# Altium schematic sheet [2]_USB_Interface.SchDoc: USB
size A3; Author: Eladio Delgado; CompanyName: bq - Mundo Reader; Organization: bq - Mundo Reader; Revision: 0; SheetNumber: 2; SheetTotal: 5
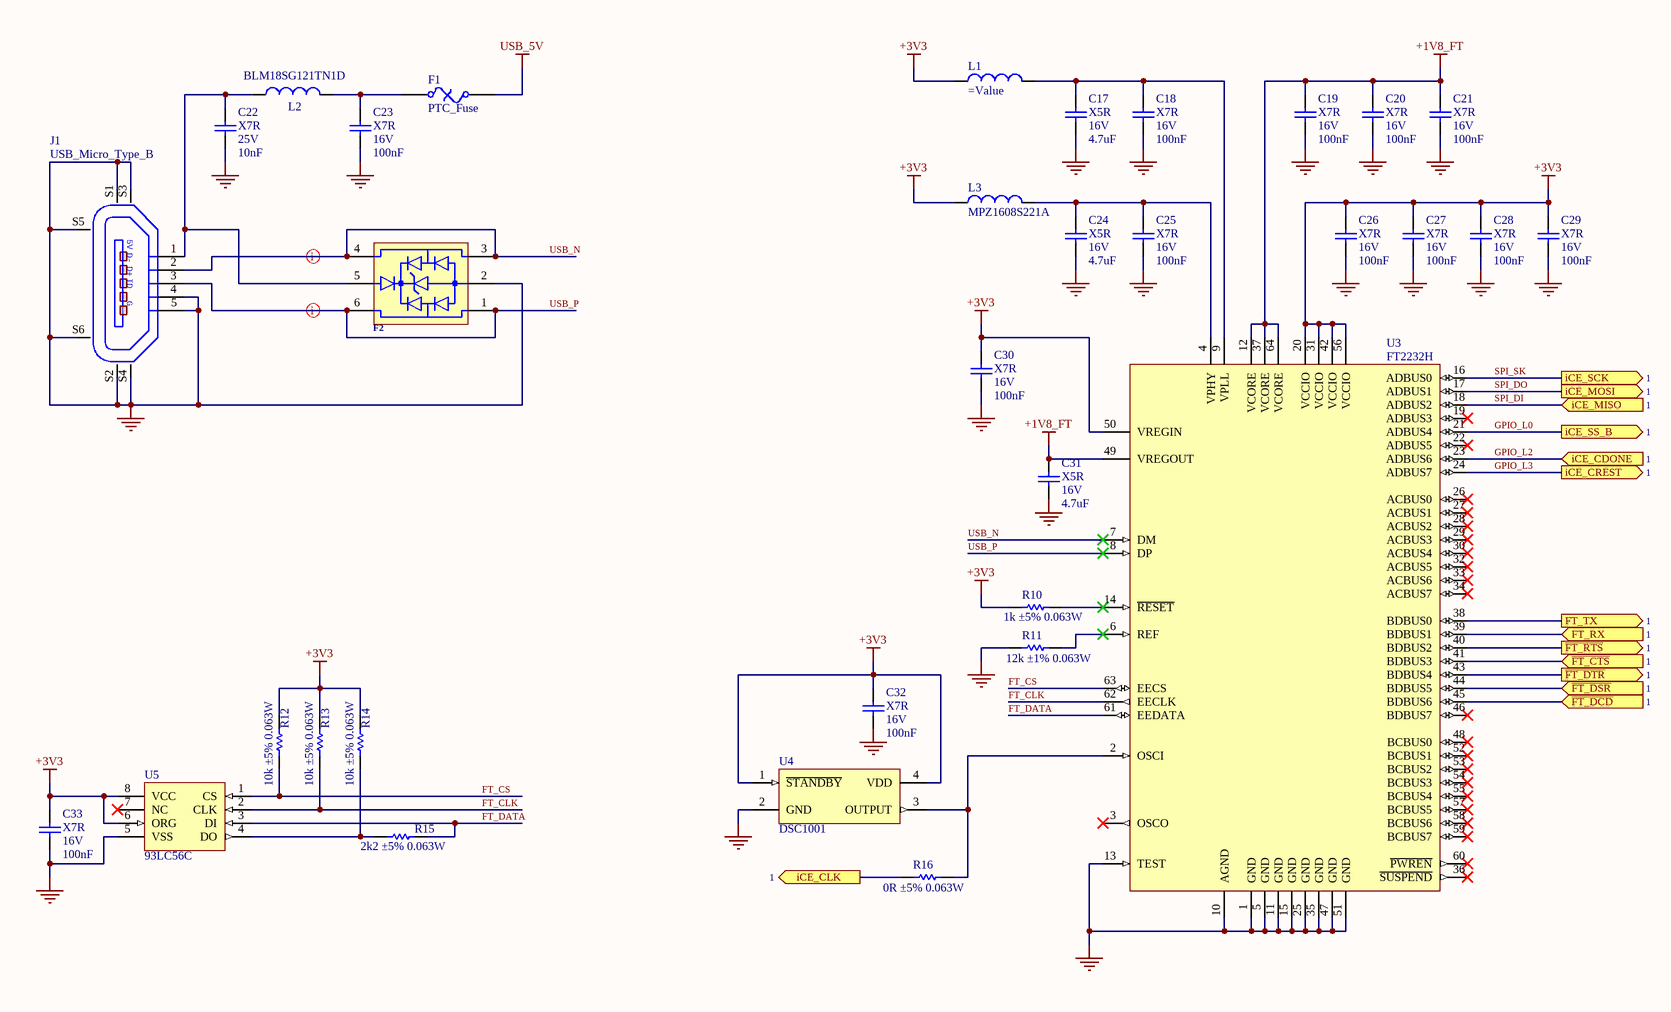
[diagram p0: [2]_USB_Interface.SchDoc]

## Parts
C17  Dielectric: X5R  Voltage: 16V  Capacitance: 4.7uF  [C0603]  (hidden comment: Capacitor)
C18  Dielectric: X7R  Voltage: 16V  Capacitance: 100nF  [C0402]  (hidden comment: Capacitor)
C19  Dielectric: X7R  Voltage: 16V  Capacitance: 100nF  [C0402]  (hidden comment: Capacitor)
C20  Dielectric: X7R  Voltage: 16V  Capacitance: 100nF  [C0402]  (hidden comment: Capacitor)
C21  Dielectric: X7R  Voltage: 16V  Capacitance: 100nF  [C0402]  (hidden comment: Capacitor)
C22  Dielectric: X7R  Voltage: 25V  Capacitance: 10nF  [C0603]  (hidden comment: Capacitor)
C23  Dielectric: X7R  Voltage: 16V  Capacitance: 100nF  [C0402]  (hidden comment: Capacitor)
C24  Dielectric: X5R  Voltage: 16V  Capacitance: 4.7uF  [C0603]  (hidden comment: Capacitor)
C25  Dielectric: X7R  Voltage: 16V  Capacitance: 100nF  [C0402]  (hidden comment: Capacitor)
C26  Dielectric: X7R  Voltage: 16V  Capacitance: 100nF  [C0402]  (hidden comment: Capacitor)
C27  Dielectric: X7R  Voltage: 16V  Capacitance: 100nF  [C0402]  (hidden comment: Capacitor)
C28  Dielectric: X7R  Voltage: 16V  Capacitance: 100nF  [C0402]  (hidden comment: Capacitor)
C29  Dielectric: X7R  Voltage: 16V  Capacitance: 100nF  [C0402]  (hidden comment: Capacitor)
C30  Dielectric: X7R  Voltage: 16V  Capacitance: 100nF  [C0402]  (hidden comment: Capacitor)
C31  Dielectric: X5R  Voltage: 16V  Capacitance: 4.7uF  [C0603]  (hidden comment: Capacitor)
C32  Dielectric: X7R  Voltage: 16V  Capacitance: 100nF  [C0402]  (hidden comment: Capacitor)
C33  Dielectric: X7R  Voltage: 16V  Capacitance: 100nF  [C0402]  (hidden comment: Capacitor)
F1  PTC_Fuse  [F1812]
F2  ESDUSB  [SOT563]  (value not drawn)
J1  USB_Micro_Type_B  [USB_Micro_B]
L1  (no value)  [L0805]
L2  BLM18SG121TN1D  [L0603]
L3  MPZ1608S221A  [L0603]
R10  value 1k ±5% 0.063W  [R0402]  (hidden comment: Resistor)
R11  value 12k ±1% 0.063W  [R0402]  (hidden comment: Resistor)
R12  value 10k ±5% 0.063W  [R0402]  (hidden comment: Resistor)
R13  value 10k ±5% 0.063W  [R0402]  (hidden comment: Resistor)
R14  value 10k ±5% 0.063W  [R0402]  (hidden comment: Resistor)
R15  value 2k2 ±5% 0.063W  [R0402]  (hidden comment: Resistor)
R16  value 0R ±5% 0.063W  [R0402]  (hidden comment: Resistor)
U3  FT2232H  [FTDI_QFN-64]
U4  DSC1001  [OSC 3.2x2.5]
U5  93LC56C  [MSOP8]

## Ports
FT_RX (in, see 1), FT_TX (out, see 1), iCE_CDONE (in, see 1), iCE_CLK (out, see 1), iCE_CREST (out, see 1), iCE_MISO (in, see 1), iCE_MOSI (out, see 1), iCE_SCK (out, see 1), iCE_SS_B (out, see 1), ~{FT_CTS} (in, see 1), ~{FT_DCD} (in, see 1), ~{FT_DSR} (in, see 1), ~{FT_DTR} (out, see 1), ~{FT_RTS} (out, see 1)

## Nets
+1V8_FT: C19.2 C20.2 C21.2 C31.2 U3.12(VCORE) U3.37(VCORE) U3.49(VREGOUT) U3.64(VCORE)
+3V3: C26.2 C27.2 C28.2 C29.2 C30.2 C32.2 C33.2 L1.1 L3.1 R10.2 R12.2 R13.2 R14.2 U3.20(VCCIO) U3.31(VCCIO) U3.42(VCCIO) U3.50(VREGIN) U3.56(VCCIO) U4.1(~{STANDBY}) U4.4(VDD) U5.6(ORG) U5.8(VCC)
GND: C17.1 C18.1 C19.1 C20.1 C21.1 C22.1 C23.1 C24.1 C25.1 C26.1 C27.1 C28.1 C29.1 C30.1 C31.1 C32.1 C33.1 F2.2 J1.4(P4) J1.5(P5) J1.S1(SHLD1) J1.S2(SHLD2) J1.S3(SHLD3) J1.S4(SHLD4) J1.S5(SHLD5) J1.S6(SHLD6) R11.2 U3.1(GND) U3.5(GND) U3.10(AGND) U3.11(GND) U3.13(TEST) U3.15(GND) U3.25(GND) U3.35(GND) U3.47(GND) U3.51(GND) U4.2(GND) U5.5(VSS)
USB_5V: F1.2
~{FT_CTS}: U3.41(BDBUS3) ; port ~{FT_CTS}
~{FT_DCD}: U3.45(BDBUS6) ; port ~{FT_DCD}
~{FT_DSR}: U3.44(BDBUS5) ; port ~{FT_DSR}
~{FT_DTR}: U3.43(BDBUS4) ; port ~{FT_DTR}
~{FT_RTS}: U3.40(BDBUS2) ; port ~{FT_RTS}
FT_CLK: R13.1 U3.62(EECLK) U5.2(CLK)
FT_CS: R12.1 U3.63(EECS) U5.1(CS)
FT_DATA: R15.1 U3.61(EEDATA) U5.3(DI)
FT_RX: U3.39(BDBUS1) ; port FT_RX
FT_TX: U3.38(BDBUS0) ; port FT_TX
GPIO_L0: U3.21(ADBUS4) ; port iCE_SS_B
GPIO_L2: U3.23(ADBUS6) ; port iCE_CDONE
GPIO_L3: U3.24(ADBUS7) ; port iCE_CREST
iCE_CLK: R16.2 ; port iCE_CLK
SPI_DI: U3.18(ADBUS2) ; port iCE_MISO
SPI_DO: U3.17(ADBUS1) ; port iCE_MOSI
SPI_SK: U3.16(ADBUS0) ; port iCE_SCK
USB_N: F2.3 F2.4 J1.2(P2) U3.7(DM)
USB_P: F2.1 F2.6 J1.3(P3) U3.8(DP)
NetC17_2: C17.2 C18.2 L1.2 U3.9(VPLL)
NetC22_2: C22.2 F2.5 J1.1(P1) L2.1
NetC23_2: C23.2 F1.1 L2.2
NetC24_2: C24.2 C25.2 L3.2 U3.4(VPHY)
NetR10_1: R10.1 U3.14(~{RESET})
NetR11_1: R11.1 U3.6(REF)
NetR14_1: R14.1 R15.2 U5.4(DO)
NetR16_1: R16.1 U3.2(OSCI) U4.3(OUTPUT)

Not connected (* = marked no-connect by the designer): U3 3(OSCO)* 19(ADBUS3)* 22(ADBUS5)* 26(ACBUS0)* 27(ACBUS1)* 28(ACBUS2)* 29(ACBUS3)* 30(ACBUS4)* 32(ACBUS5)* 33(ACBUS6)* 34(ACBUS7)* 36(~{SUSPEND})* 46(BDBUS7)* 48(BCBUS0)* 52(BCBUS1)* 53(BCBUS2)* 54(BCBUS3)* 55(BCBUS4)* 57(BCBUS5)* 58(BCBUS6)* 59(BCBUS7)* 60(~{PWREN})*; U5 7(NC)*

## Layout directives
differential pair: USB_N, USB_P

## Notes on the sheet
- Title
- Project
- Size:
- Author
- A3
- Number:
- Revision:
- Mundo Reader, S.L. This project and all the sheets and layouts enclosed are licensed under Creative Commons by Attribution and Share Alike [CC BY-SA] (www.creativecommons.com)
- Date:
- Time:
- Sheet
- of
- (in symbol Micro USB Type B SMD) 5V; D-; D+; ID; G

## Library data of the parts
C17 C24 C31 = C0603_4.7uF_16V_±10%: Capacitor SMD; Manufacturer: TDK; Value: 4.7uF ±10% 16V; Tolerance: ±10%; OrderingCode: C1608X5R1C475K080AC; Temp_ Max: 85; Temp_ Min: -55; Part Number: C0603_4.7uF_16V_±10%; Price (€): 0,068
C18-C21 C23 C25-C30 C32 C33 = C0402_100nF_16V_±10%: Capacitor SMD; Manufacturer: Kemet; Value: 100nF ±10% 16V; Tolerance: ±10%; OrderingCode: C0402C104K4RAC; Temp_ Max: 125; Temp_ Min: -55; Part Number: C0402_100nF_16V_±10%; Price (€): 0,05
C22 = C0603_10nF_25V_±10%: Manufacturer: Kemet; Value: 10nF ±10% 25V; Tolerance: ±10%; OrderingCode: C0603C103K3RAC; Temp_ Max: 125; Temp_ Min: -55; Part Number: C0603_10nF_25V_±10%; Price (€): 0,035
F1 = FUSE 0.5A 15V: PTC Resettable Fuse; Manufacturer: Bourns; Voltage: 15V; Current: 0.5A; OrderingCode: MF-MSMF050-2; Temp_ Max: 85; Temp_ Min: -40; Part Number: FUSE 0.5A 15V; Price (€): 0,108; Supplier: Abacus
F2 = USB ESD Single: Protection, USB ESD; Manufacturer: Würth; OrderingCode: 82400152; Temp_ Max: 125; Temp_ Min: -40; OrderingCode 2: CDSOT563-0502; Part Number: USB ESD Single; Supplier: Würth; Price (€): 0,1; Manufacturer 2: Bourns
J1 = Micro USB Type B SMD: Connector, USB Micro B; Manufacturer: FCI; OrderingCode: 10118192-0001LF; Temp_ Max: 85; Temp_ Min: -30; OrderingCode 2: ZX62-B-5PA-11; Part Number: Micro USB Type B SMD; Supplier: Abacus; Price (€): 0,11; Manufacturer 2: Hirose Connector
L1 = 10uH_0,1A: Inductor SMD; Manufacturer: muRata; L: 10uH; Rdc: 0,60R; Current: 0,1A; OrderingCode: LQM21FN100M70L; Temp_ Max: 125; Temp_ Min: -55; Value: 10uH 0,1A; Part Number: 10uH_0,1A; Price (€): 0,062
L2 = L0603_120R_0,025R_3000mA: Manufacturer: Murata; Resistance_100MHz: 120R; Resistance_DC: 0,025R; Current: 3000mA; Temp_ Max: 125; Temp_ Min: -55; Value: 120R 0,025R 3000mA; Part Number: L0603_120R_0,025R_3000mA; OrderingCode: BLM18SG121TN1D; Price (€): 0,053
L3 = L0603_220R_0,05R_2200mA: Ferrite Bead; Manufacturer: TDK; Resistance_100MHz: 220R; Resistance_DC: 0,05R; Current: 2200mA; Temp_ Max: 125; Temp_ Min: -55; Value: 220R 0,05R 2200mA; Part Number: L0603_220R_0,05R_2200mA; OrderingCode: MPZ1608S221A; Price (€): 0,025
R10 = R0402_1k_0.063W_±5%: Manufacturer: Vishay; Tolerance: ±5%; OrderingCode: CRCW04021K00JN; Power: 0.063W; Resistance: 1k; Temp_ Max: 155; Temp_ Min: -55; PackageDescription: SMD; Part Number: R0402_1k_0.063W_±5%; Price (€): 0,003
R11 = R0402_12k_0.063W_±1%: Resistor, SMD; Manufacturer: Vishay; Tolerance: ±1%; OrderingCode: CRCW040212K0FK; Power: 0.063W; Resistance: 12k; Temp_ Max: 155; Temp_ Min: -55; PackageDescription: SMD; Part Number: R0402_12k_0.063W_±1%; Price (€): 0,006
R12-R14 = R0402_10k_0.063W_±5%: Resistor, SMD; Manufacturer: Vishay; Tolerance: ±5%; OrderingCode: CRCW040210K0JN; Power: 0.063W; Resistance: 10k; Temp_ Max: 155; Temp_ Min: -55; PackageDescription: SMD; Part Number: R0402_10k_0.063W_±5%; Price (€): 0,003
R15 = R0402_2k2_0.063W_±5%: Resistor, SMD; Manufacturer: Vishay; Tolerance: ±5%; OrderingCode: CRCW04022K20JN; Power: 0.063W; Resistance: 2k2; Temp_ Max: 155; Temp_ Min: -55; PackageDescription: SMD; Part Number: R0402_2k2_0.063W_±5%; Price (€): 0,003
R16 = R0402_0R_0.063W_±5%: Resistor, SMD; Manufacturer: Panasonic; Tolerance: ±5%; OrderingCode: ERJ-2GE0R00X; Power: 0.063W; Resistance: 0R; Temp_ Max: 155; Temp_ Min: -55; OrderingCode 2: CRCW04020000Z0; PackageDescription: SMD; Part Number: R0402_0R_0.063W_±5%; Price (€): 0,003; Manufacturer 2: Vishay
U3 = FT2232H: Dual High Speed USB to Multipurpose UART/FIFO IC; Manufacturer: FTDI; OrderingCode: FT2232HQ-REEL; Temp_ Max: 85; Temp_ Min: -40; Part Number: FT2232H; Supplier: Silica; Price (€): 3,45
U4 = DSC1001-12MHZ: Oscillator, Low-Power CMOS, 4 pin, 1.8-3.3V; Manufacturer: Microchip; OrderingCode: DSC1001CL2-012.0000; Temp_ Max: 105; Temp_ Min: -40; Value: 12MHz; Part Number: DSC1001-12MHZ; Price (€): 0,61
U5 = 93LC56C: EEPROM, 2K Microwire Compatible Serial, 8 or 16 bit word size, 2.5-5.5 Vcc range; Manufacturer: Microchip; OrderingCode: 93LC56CT-I/MS; Temp_ Max: 85; Temp_ Min: -40; Value: 2Kb; Part Number: 93LC56C; Supplier: Silica; Price (€): 0,24